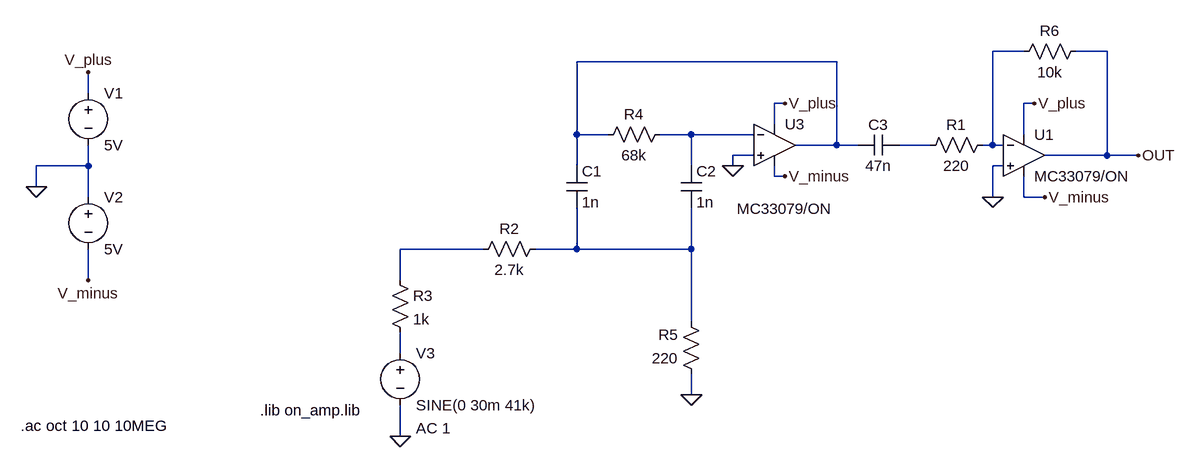
[diagram p0: schematic opamp_rec_filter.asc]
opamp_rec_filter.asc, the LTspice schematic file:
Version 4
SHEET 1 1052 680
WIRE 800 16 752 16
WIRE 928 16 880 16
WIRE 512 32 112 32
WIRE -640 80 -640 48
WIRE 432 96 416 96
WIRE 816 96 800 96
WIRE 416 128 416 96
WIRE 112 144 112 32
WIRE 160 144 112 144
WIRE 288 144 240 144
WIRE 384 144 288 144
WIRE 800 144 800 96
WIRE 512 160 512 32
WIRE 512 160 448 160
WIRE 544 160 512 160
WIRE 656 160 608 160
WIRE 752 160 752 16
WIRE 752 160 736 160
WIRE 768 160 752 160
WIRE 384 176 352 176
WIRE 928 176 928 16
WIRE 928 176 832 176
WIRE 976 176 928 176
WIRE -640 192 -640 160
WIRE -640 192 -720 192
WIRE 112 192 112 144
WIRE 288 192 288 144
WIRE 352 192 352 176
WIRE 768 192 752 192
WIRE 416 208 416 192
WIRE 432 208 416 208
WIRE -720 224 -720 192
WIRE -640 240 -640 192
WIRE 752 240 752 192
WIRE 800 240 800 208
WIRE 832 240 800 240
WIRE -32 320 -160 320
WIRE 112 320 112 256
WIRE 112 320 48 320
WIRE 288 320 288 256
WIRE 288 320 112 320
WIRE -640 368 -640 320
WIRE -160 368 -160 320
WIRE 288 432 288 320
WIRE -160 480 -160 448
WIRE 288 544 288 512
WIRE -160 608 -160 560
FLAG -720 224 0
FLAG -640 48 V_plus
FLAG -640 368 V_minus
FLAG -160 608 0
FLAG 432 208 V_minus
FLAG 432 96 V_plus
FLAG 832 240 V_minus
FLAG 816 96 V_plus
FLAG 976 176 OUT
FLAG 752 240 0
FLAG 288 544 0
FLAG 352 192 0
SYMBOL voltage -640 64 R0
WINDOW 123 0 0 Left 0
WINDOW 39 0 0 Left 0
SYMATTR InstName V1
SYMATTR Value 5V
SYMBOL voltage -640 224 R0
WINDOW 123 0 0 Left 0
WINDOW 39 0 0 Left 0
SYMATTR InstName V2
SYMATTR Value 5V
SYMBOL voltage -160 464 R0
WINDOW 123 24 132 Left 0
WINDOW 39 0 0 Left 0
SYMATTR Value2 AC 1
SYMATTR InstName V3
SYMATTR Value SINE(0 30m 41k)
SYMBOL res -176 352 R0
SYMATTR InstName R3
SYMATTR Value 1k
SYMBOL Opamps\\opamp2 416 96 R0
WINDOW 3 -58 162 Left 0
SYMATTR Value MC33079/ON
SYMATTR InstName U3
SYMBOL Opamps\\opamp2 800 112 R0
SYMATTR InstName U1
SYMATTR Value MC33079/ON
SYMBOL res 752 144 R90
WINDOW 0 0 56 VBottom 0
WINDOW 3 32 56 VTop 0
SYMATTR InstName R1
SYMATTR Value 220
SYMBOL res 896 0 R90
WINDOW 0 0 56 VBottom 0
WINDOW 3 32 56 VTop 0
SYMATTR InstName R6
SYMATTR Value 10k
SYMBOL res 64 304 R90
WINDOW 0 0 56 VBottom 0
WINDOW 3 32 56 VTop 0
SYMATTR InstName R2
SYMATTR Value 2.7k
SYMBOL res 256 128 R90
WINDOW 0 0 56 VBottom 0
WINDOW 3 32 56 VTop 0
SYMATTR InstName R4
SYMATTR Value 68k
SYMBOL res 304 528 R180
WINDOW 0 36 76 Left 0
WINDOW 3 36 40 Left 0
SYMATTR InstName R5
SYMATTR Value 220
SYMBOL cap 96 192 R0
SYMATTR InstName C1
SYMATTR Value 1n
SYMBOL cap 272 192 R0
SYMATTR InstName C2
SYMATTR Value 1n
SYMBOL cap 608 144 R90
WINDOW 0 0 32 VBottom 0
WINDOW 3 32 32 VTop 0
SYMATTR InstName C3
SYMATTR Value 47n
TEXT -376 568 Left 0 !.lib on_amp.lib
TEXT -744 592 Left 0 !.ac oct 10 10 10MEG

The netlist it stands for:
* opamp_rec_filter.asc
V1 V_plus 0 5V
V2 0 V_minus 5V
V3 N007 0 SINE(0 30m 41k) AC 1
R3 N005 N007 1k
XU3 0 N003 V_plus V_minus N002 MC33079/ON  ; pins In+ In- V+ V- OUT
XU1 0 N001 V_plus V_minus OUT MC33079/ON  ; pins In+ In- V+ V- OUT
R1 N001 N004 220
R6 OUT N001 10k
R2 N006 N005 2.7k
R4 N003 N002 68k
R5 0 N006 220
C1 N002 N006 1n
C2 N003 N006 1n
C3 N004 N002 47n
.lib on_amp.lib
.ac oct 10 10 10MEG
.backanno
.end